# EAGLE design PCM2707C_HeadPhone_V2 (EAGLE 6.4)
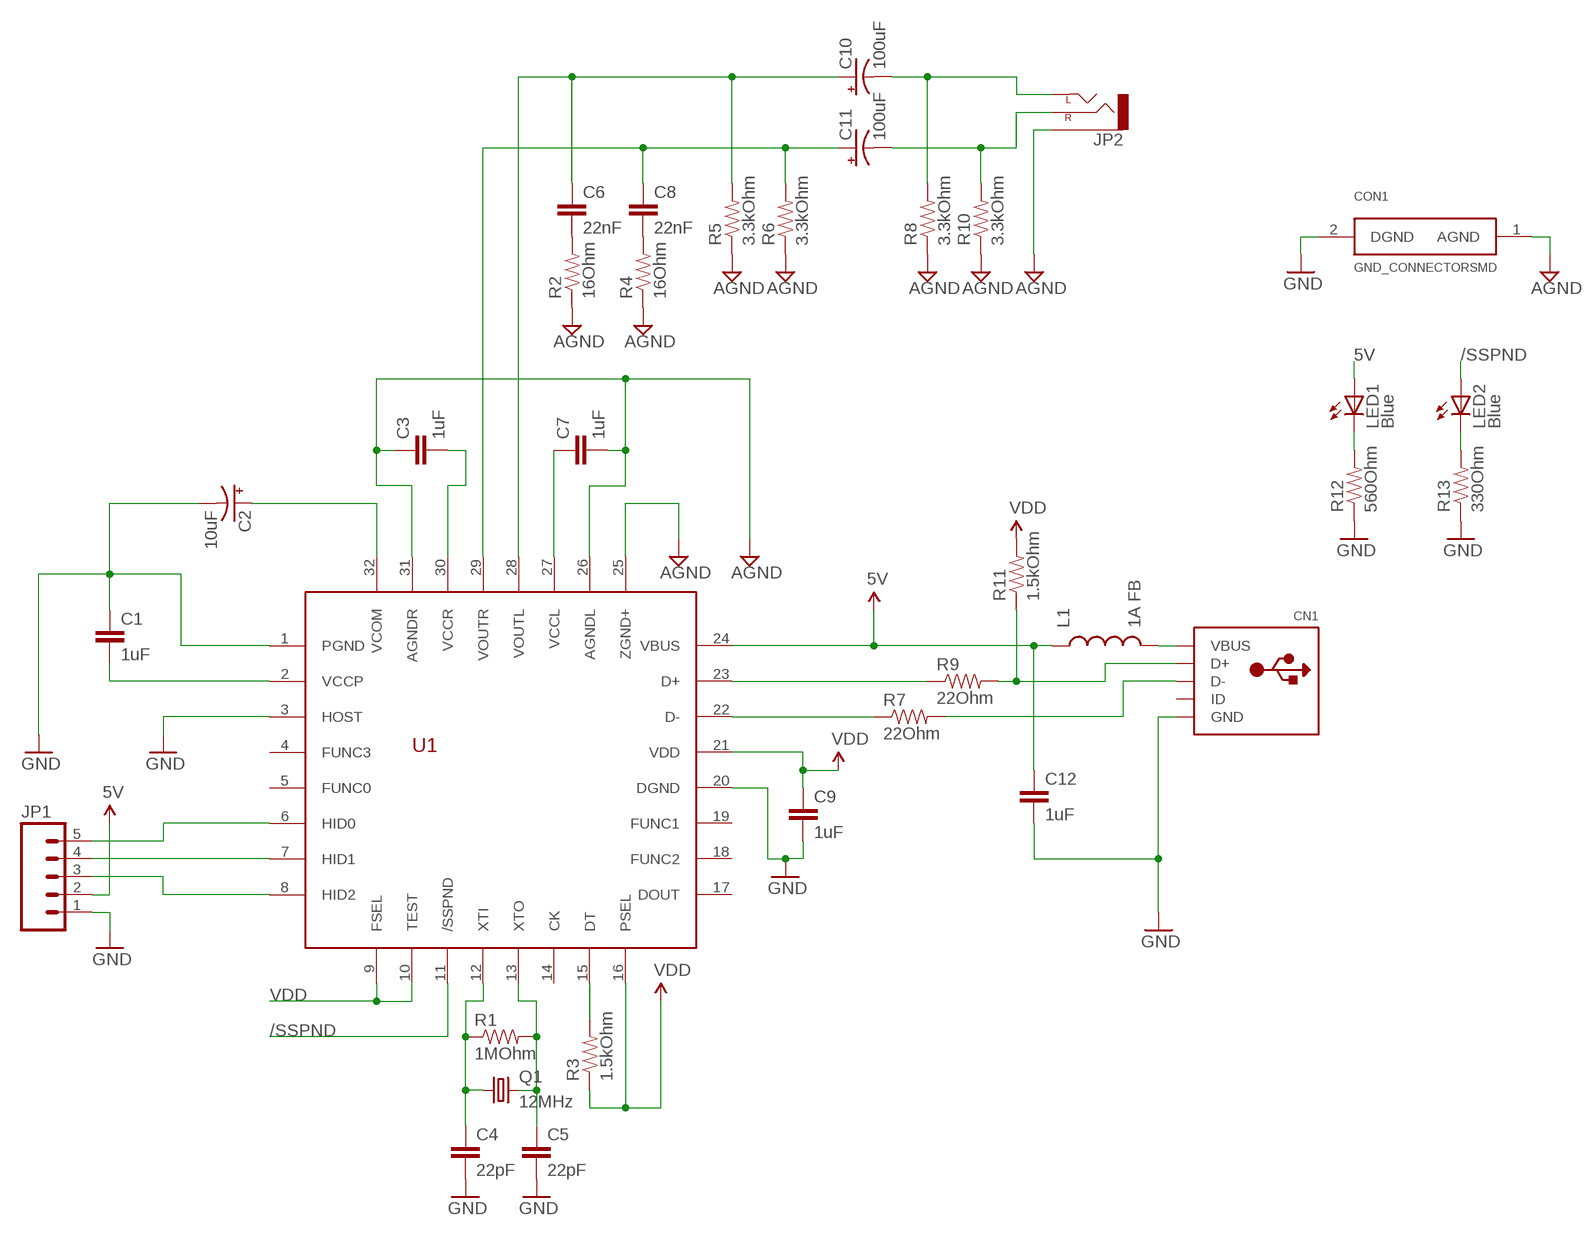
[diagram p0: schematic, sheet 1]

## Parts
C1  1uF  CAP0805  [0805]
C2  10uF  CAP_POLC  [PANASONIC_C]
C3  1uF  CAP0805  [0805]
C4  22pF  CAP0805  [0805]
C5  22pF  CAP0805  [0805]
C6  22nF  CAP1210  [1210]
C7  1uF  CAP0805  [0805]
C8  22nF  CAP1210  [1210]
C9  1uF  CAP0805  [0805]
C10  100uF  CAP_POLD  [PANASONIC_D]
C11  100uF  CAP_POLD  [PANASONIC_D]
C12  1uF  CAP0805  [0805]
CN1  USBMINIB  [USB-MINIB]
CON1  GND_CONNECTORSMD  [GND_CONNECTOR]
JP1  M05LOCK  [1X05_LOCK]
JP2  AUDIO-JACKPTH  [AUDIO-JACK]
L1  1A FB  INDUCTOR0805  [0805]
LED1  Blue  LED0603  [LED-0603]
LED2  Blue  LED0603  [LED-0603]
Q1  12MHz  CRYSTALHC49U-V  [HC49U-V]
R1  1MOhm  RESISTOR0805-RES  [0805]
R2  16Ohm  RESISTOR0805-RES  [0805]
R3  1.5kOhm  RESISTOR0805-RES  [0805]
R4  16Ohm  RESISTOR0805-RES  [0805]
R5  3.3kOhm  RESISTOR0805-RES  [0805]
R6  3.3kOhm  RESISTOR0805-RES  [0805]
R7  22Ohm  RESISTOR0805-RES  [0805]
R8  3.3kOhm  RESISTOR0805-RES  [0805]
R9  22Ohm  RESISTOR0805-RES  [0805]
R10  3.3kOhm  RESISTOR0805-RES  [0805]
R11  1.5kOhm  RESISTOR0805-RES  [0805]
R12  560Ohm  RESISTOR0805-RES  [0805]
R13  330Ohm  RESISTOR0805-RES  [0805]
U1  PCM2707C_TQFP32"  [32TQFP_PCM2707C]

## Nets
5V: C12.1 JP1.2 L1.1 LED1.A U1.24(VBUS)
/SSPND: LED2.A U1.11(/SSPND)
AGND: C3.1 C7.2 CON1.1(AGND) JP2.SLEEVE R2.1 R4.1 R5.1 R6.1 R8.1 R10.1 U1.25(ZGND+) U1.26(AGNDL) U1.31(AGNDR)
GND: C1.1 C2.- C4.2 C5.2 C9.2 C12.2 CN1.GND CON1.2(DGND) JP1.1 R12.1 R13.1 U1.1(PGND) U1.3(HOST) U1.20(DGND)
N$1: JP1.5 U1.6(HID0)
N$2: C1.2 U1.2(VCCP)
N$3: JP1.4 U1.7(HID1)
N$4: C2.+ U1.32(VCOM)
N$5: JP1.3 U1.8(HID2)
N$6: CN1.VBUS L1.2
N$7: C4.1 Q1.1 R1.1 U1.12(XTI)
N$8: C5.1 Q1.2 R1.2 U1.13(XTO)
N$9: R9.1 U1.23(D+)
N$10: R7.1 U1.22(D-)
N$11: CN1.D+ R9.2 R11.1
N$12: CN1.D- R7.2
N$13: C3.2 U1.30(VCCR)
N$14: LED1.C R12.2
N$15: R3.2 U1.15(DT)
N$16: C7.1 U1.27(VCCL)
N$17: C8.2 R4.2
N$18: C6.2 R2.2
N$19: C11.- JP2.RING(RIGHT) R10.2
N$20: C10.- JP2.TIP(LEFT) R8.2
N$21: C8.1 C11.+ R6.2 U1.29(VOUTR)
N$22: LED2.C R13.2
N$23: C6.1 C10.+ R5.2 U1.28(VOUTL)
VDD: C9.1 R3.1 R11.2 U1.9(FSEL) U1.10(TEST) U1.16(PSEL) U1.21(VDD)
Unconnected: CN1.ID U1.4(FUNC3) U1.5(FUNC0) U1.14(CK) U1.17(DOUT) U1.18(FUNC2) U1.19(FUNC1)

## Library data of the parts
C1 C3-C9 C12 = SparkFun-Passives:CAP: Capacitor Standard 0603 ceramic capacitor, and 0.1" leaded capacitor.
C2 C10 C11 = SparkFun-Passives:CAP_POL: Capacitor Polarized These are standard SMD and PTH capacitors. Normally 10uF, 47uF, and 100uF in electrolytic and tantalum varieties. Always verify the external diameter of the through hole cap, it varies with capacity, voltage, and manufacturer. The EIA devices should be standard.
CN1 = adafruit:USB: USB Connectors USBMINIB - Surface Mount Female Mini-B USB Connector 4UConnector: 06564 By microbuilder.eu Thru-hole RA Female Mini-B USB Connector 4UConnector: 18732 By ladyada.net
CON1 = lowderlib:GND_CONNECTOR
JP1 = SparkFun-Connectors:M05: Header 5 Standard 5-pin 0.1" header. Use with straight break away headers (SKU : PRT-00116), right angle break away headers (PRT-00553), swiss pins (PRT-00743), machine pins (PRT-00117), and female headers (PRT-00115). Molex polarized connector foot print use with SKU : PRT-08230 with associated crimp pins and housings.
JP2 = SparkFun-Connectors:AUDIO-JACK: 3.5mm Audio Jack Simple 3.5mm common PCB mount audio jack. SKU: PRT-08032
L1 = SparkFun-Passives:INDUCTOR: Inductors Basic Inductor/Choke - 0603 and 1206. Footprints are not proven and vary greatly between part numbers. SRN6045- 33uH, 20% 1.4A SDR0403-560KL - 56uH, 10%, 500mA RMS/740mA peak
LED1 LED2 = SparkFun-LED:LED: LEDs Standard schematic elements and footprints for 5mm, 3mm, 1206, and 0603 sized LEDs. 5mm - Spark Fun Electronics SKU : COM-00529 (and others)
Q1 = crystal:CRYSTAL: CRYSTAL; OC_FARNELL: 1666969; OC_NEWARK: unknown
R1-R13 = SparkFun-Passives:RESISTOR: Resistor Basic schematic elements and footprints for 0603, 1206, and PTH resistors.
U1 = lowderlib:PCM2707C_TQFP32: Stereo Audio DAC with USB Interface, Single-Ended Headphone Output, and S/PDIF Output

## Board
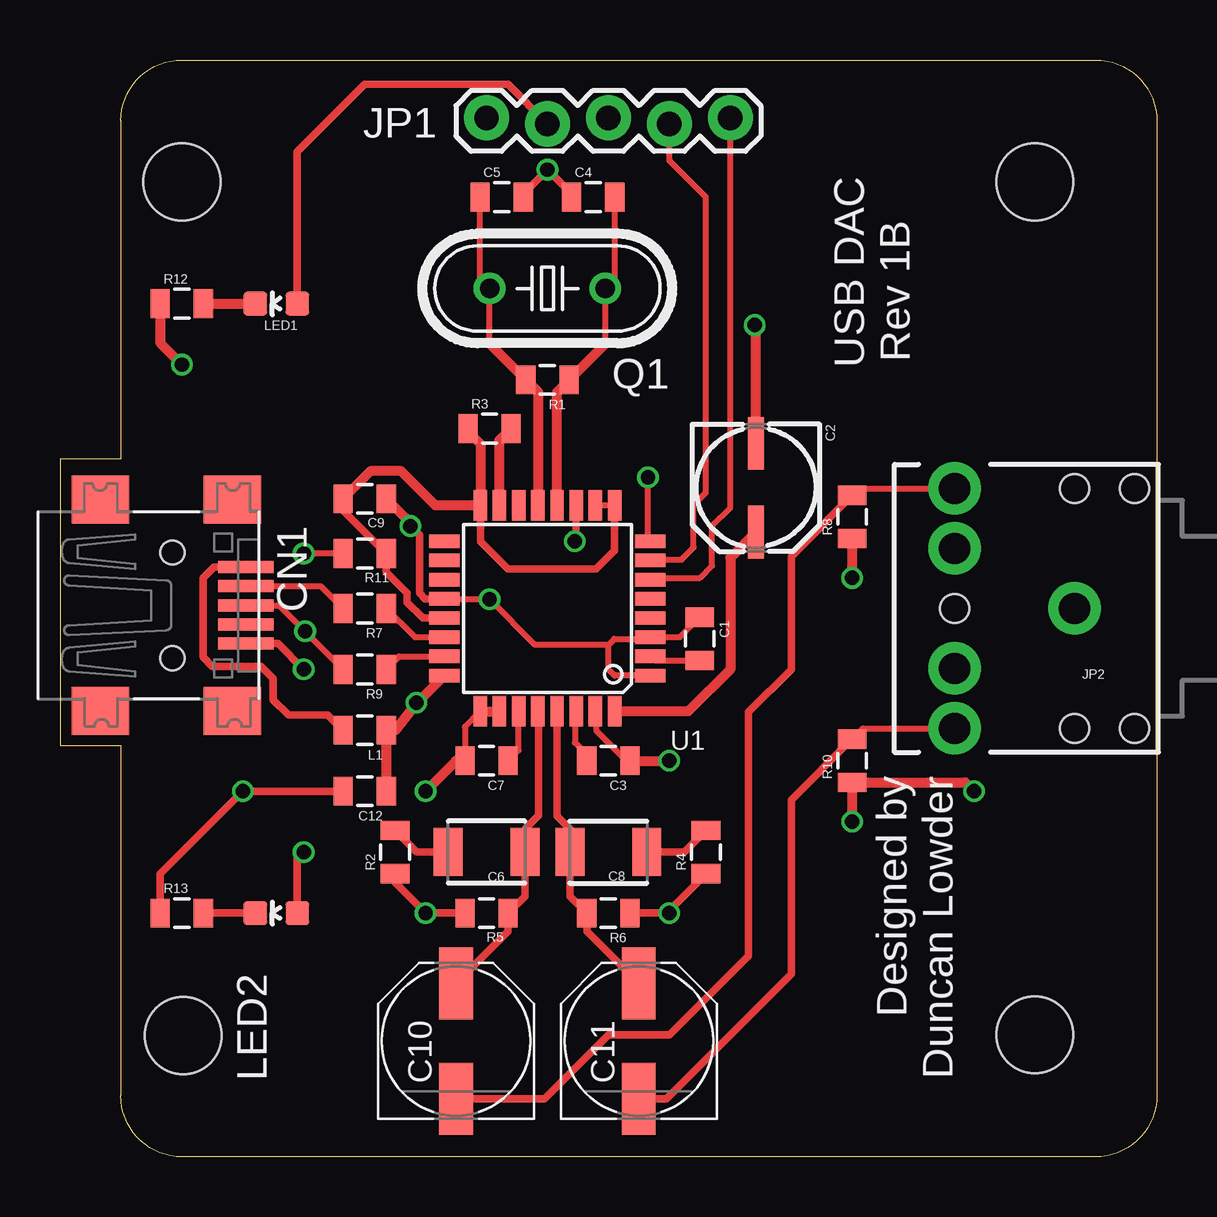
[diagram p1: board, top side]
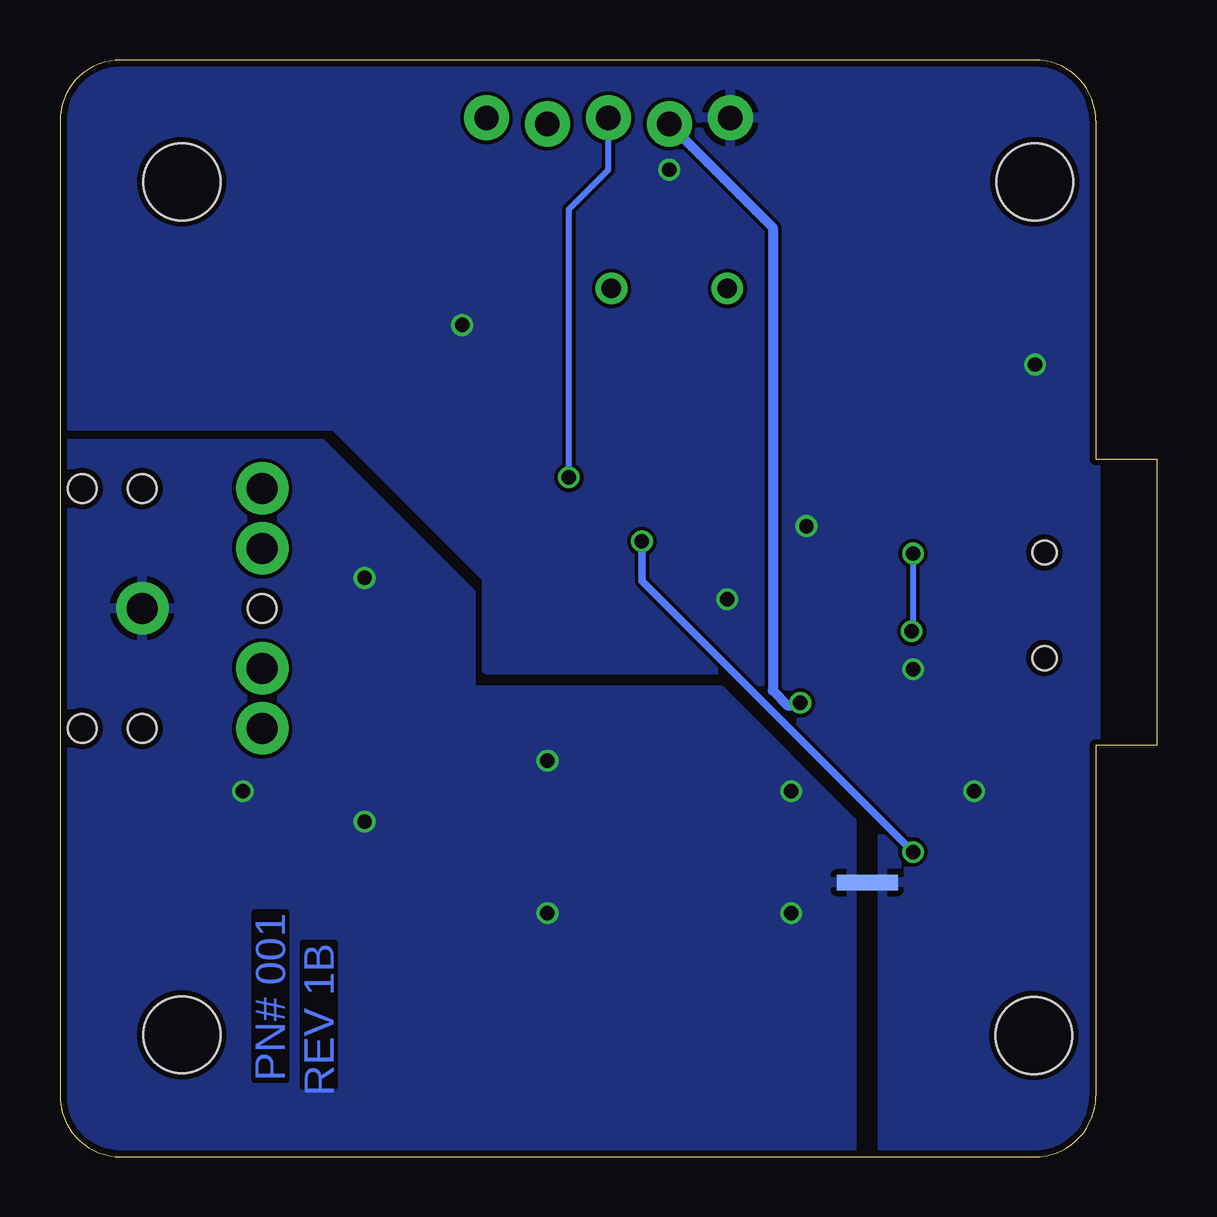
[diagram p2: board, bottom side, seen from below]

Size 45.72 x 45.72 mm. Coordinates in mm from the lower left corner, seen from the top.
Outline: 2.54,43.18 arc-90 5.08,45.72 43.18,45.72 arc-90 45.72,43.18 45.72,2.54 arc-90 43.18,0 5.08,0 arc-90 2.54,2.54 2.54,17.14 0,17.14 0,29.08 2.54,29.08 2.54,43.18
Copper layers (1*16): Top 0.035mm / dielectric 1.5mm / Bottom 0.035mm
Design rules "SeeedStudio_2layer_DRU_no_angle_20140221": minimum track width 6mil, minimum drill 12mil, track to track 6mil, track to pad 6mil, pad to pad 6mil, via to via 6mil, smd to smd 0mil, copper to edge 10mil, drill to drill 10mil, minimum pad ring 10mil, minimum via ring 6mil, stop-mask expansion 2mil, vias tented up to drill 100mil, thermal gap 10mil
Holes 3.2 mm at 5.08,40.64 40.64,40.64 40.64,5.08 5.13,5.05

### Footprints (pad centres in the part's own frame; a part is rotated, then mirrored left to right if it is on the bottom)
0805 = smd 0.8 x 1.2: 1 -0.9,0; 2 0.9,0
PANASONIC_C = smd 2.2 x 0.65: + 1.9,-0.2; - -1.8,-0.2
1210 = smd 1.2 x 2: 1 -1.6,0; 2 1.6,0
PANASONIC_D = smd 3 x 1.4: + 2.4,0; - -2.4,0
USB-MINIB = smd 0.5 x 2.308: D+ 0,4.064; D- -0.8,4.064; GND 1.6,4.064; ID 0.8,4.064; VBUS -1.6,4.064 | smd 2 x 2.4: GND1 -4.4,-2; GND2 -4.4,3.5; GND3 4.4,3.5; GND4 4.4,-2 | hole 1: -2.2,1; 2.2,1
GND_CONNECTOR = smd 1.27 x 0.635: 1 -1.27,0; 2 0,0
1X05_LOCK = drill 1.016 pad 1.88: 1 0,0.127; 2 2.54,-0.127; 3 5.08,0.127; 4 7.62,-0.127; 5 10.16,0.127
AUDIO-JACK = drill 1.3 pad 2.184: RING 5,5; RSH 5,2.5; SLEEVE 0,0; TIP 5,-5; TSH 5,-2.5 | hole 1.2: 0,5; -2.5,5; -2.5,-5; 0,-5; 5,0
LED-0603 = smd 1 x 1: A 0,-0.877; C 0,0.877
HC49U-V = drill 0.813: 1 -2.413,0; 2 2.413,0
32TQFP_PCM2707C = smd 1.27 x 0.559: 1 -4.293,2.8; 2 -4.293,2; 3 -4.293,1.2; 4 -4.293,0.4; 5 -4.293,-0.4; 6 -4.293,-1.2; 7 -4.293,-2; 8 -4.293,-2.8; 17 4.293,-2.8; 18 4.293,-2; 19 4.293,-1.2; 20 4.293,-0.4; 21 4.293,0.4; 22 4.293,1.2; 23 4.293,2; 24 4.293,2.8 | smd 0.559 x 1.27: 9 -2.8,-4.293; 10 -2,-4.293; 11 -1.2,-4.293; 12 -0.4,-4.293; 13 0.4,-4.293; 14 1.2,-4.293; 15 2,-4.293; 16 2.8,-4.293; 25 2.8,4.293; 26 2,4.293; 27 1.2,4.293; 28 0.4,4.293; 29 -0.4,4.293; 30 -1.2,4.293; 31 -2,4.293; 32 -2.8,4.293

### Placement (x,y rotation side)
C1  26.67,21.59 270 top
C2  29.21,27.94 270 top
C3  22.86,16.51 180 top
C4  22.23,40.01 180 top
C5  18.41,40.01 0 top
C6  17.78,12.7 180 top
C7  17.78,16.51 180 top
C8  22.86,12.7 0 top
C9  12.7,27.43 0 top
C10  16.51,4.83 90 top
C11  24.13,4.83 90 top
C12  12.7,15.24 180 top
CN1  3.68,22.99 270 top
CON1  11.43,11.43 0 bottom
JP1  17.78,43.18 0 top
JP2  42.29,22.86 180 top
L1  12.7,17.78 180 top
LED1  9.02,35.56 90 top
LED2  9.02,10.16 90 top
Q1  20.32,36.2 180 top
R1  20.32,32.38 180 top
R2  13.97,12.7 90 top
R3  17.91,30.35 0 top
R4  26.92,12.7 90 top
R5  17.78,10.16 0 top
R6  22.86,10.16 180 top
R7  12.7,22.86 180 top
R8  33.02,26.67 90 top
R9  12.7,20.32 180 top
R10  33.02,16.51 90 top
R11  12.7,25.15 0 top
R12  5.08,35.56 0 top
R13  5.08,10.16 0 top
U1  20.32,22.86 180 top

### Tracks (layer width: path | path; a pad name or v marks a point on that pad's centre or on a via)
5V  (via drill 0.6)
  Top 0.305: LED1.A 9.89,41.9 12.7,44.7 18.67,44.7 JP1.2
  Top 0.406: C12.1 L1.1 13.97,17.78 v14.86,18.92 14.99,19.02 U1.24
  Bottom 0.406: JP1.2 16,38.73 16,19.43 15.37,18.8 v14.86,18.92
/SSPND  (via drill 0.6)
  Top 0.305: U1.11 21.52,25.71 v21.46,25.65 | LED2.A 9.89,12.43 v10.16,12.7
  Bottom 0.305: v21.46,25.65 21.46,24 v10.16,12.7
AGND  (via drill 0.6)
  Top 0.254: U1.25 16.88,17.93 C7.2 | U1.31 22.35,18.54 22.35,17.78 23.62,16.51 C3.1
  Top 0.305: R2.1 13.97,11.43 v15.24,10.16 R5.1 | R6.1 v25.4,10.16 25.4,10.28 R4.1
  Top 0.406: R8.1 v33.02,24.13 | v33.02,13.97 R10.1 37.73,15.61 v38.1,15.24 | C7.2 16.51,16.51 v15.24,15.24 | C3.1 v25.4,16.51 | U1.25 U1.26
  Bottom 0.406: JP2.SLEEVE 41.91,22.86
  pour Bottom: 12.7,0 12.7,13.97 18.16,19.43 28.57,19.43 28.57,23.5 34.8,29.72 45.72,29.72 45.72,0
GND  (via drill 0.6)
  Top 0.254: U1.1 23.12,20.06 22.86,20.32 22.86,21.34 | 22.86,21.34 23.11,21.59 24.54,21.59 U1.3 25.84,21.66 C1.1 | U1.20 17.89,23.26 v17.91,23.24 19.81,21.34 22.86,21.34
  Top 0.305: U1.20 15.22,23.26 14.99,23.5 14.99,25.91 v14.61,26.29 | C12.2 v7.62,15.24 4.18,11.8 R13.1 | CN1.GND 9.09,21.39 v10.16,20.32 | C4.2 21.32,40.14 v20.32,41.15 19.32,40.14 C5.2
  Top 0.406: C2.- 29.01,34.62 v28.96,34.67 | v14.61,26.29 14.61,26.43 C9.2 | R12.1 4.18,33.92 v5.08,33.02
  pour Bottom: 2.54,45.72 45.72,45.72 45.72,30.48 34.29,30.48 27.94,24.13 27.94,20.32 17.78,20.32 11.43,13.97 11.43,0 2.54,0
N$1
  Top 0.254: U1.6 24.68,24.13 26.67,24.13 27.18,24.64 27.18,26.29 27.94,27.05 JP1.5
N$2
  Top 0.254: U1.2 24.78,20.69 C1.2
N$3
  Top 0.254: U1.7 24.64,24.89 25.91,24.89 26.42,25.4 26.42,27.18 26.92,27.69 26.92,40.01 25.4,41.53 JP1.4
N$4
  Top 0.406: C2.+ 27.94,24.97 27.94,20.32 26.19,18.57 U1.32
N$5  (via drill 0.6)
  Top 0.254: U1.8 24.51,25.76 v24.51,28.32
  Bottom 0.254: v24.51,28.32 24.51,39.5 22.86,41.15 JP1.3
N$6
  Top 0.305: CN1.VBUS 6.43,24.59 5.97,24.13 5.97,20.83 6.35,20.45 8.38,20.45 8.89,19.94 8.89,19.05 9.53,18.41 11.16,18.41 L1.2
N$7
  Top 0.254: 22.73,33.9 Q1.1 23.12,36.59 C4.1
  Top 0.406: U1.12 20.72,31.89 R1.1 22.73,33.9
N$8
  Top 0.254: 17.91,33.9 Q1.2 17.52,36.59 C5.1
  Top 0.406: U1.13 19.94,27.15 19.94,31.87 R1.2 17.91,33.9
N$9
  Top 0.254: R9.1 14.14,20.86 U1.23
N$10
  Top 0.254: R7.1 14.8,21.66 U1.22
N$11  (via drill 0.6)
  Top 0.254: CN1.D+ 9.13,22.99 10.15,21.96 v10.22,21.9 R9.2 | R11.1 v10.16,25.15
  Bottom 0.254: v10.16,25.15 10.16,21.96 v10.22,21.9
N$12
  Top 0.254: CN1.D- 10.87,23.79 R7.2
N$13
  Top 0.254: U1.30 21.46,18.51 21.46,17.27 21.96,16.77 C3.2
N$14
  Top 0.406: R12.2 LED1.C
N$15
  Top 0.406: U1.15 18.32,29.87 R3.2
N$16
  Top 0.254: C7.1 19.12,16.95 U1.27
N$17
  Top 0.305: C8.2 26.02,12.7 R4.2
N$18
  Top 0.305: C6.2 14.87,12.7 R2.2
N$19
  Top 0.254: R10.2 33.47,17.86 JP2.RING
  Top 0.305: C11.- 25.29,2.43 30.48,7.62 30.48,14.87 R10.2
N$20
  Top 0.254: R8.2 33.31,27.86 JP2.TIP
  Top 0.305: C10.- 20.21,2.43 22.86,5.08 25.4,5.08 28.7,8.38 28.7,18.54 30.48,20.32 30.48,25.03 R8.2
N$21
  Top 0.305: U1.29 20.72,14.21 21.34,13.59 21.34,12.78 C8.1 21.26,10.86 R6.2 21.96,9.4 C11.+
N$22
  Top 0.305: LED2.C R13.2
N$23
  Top 0.305: U1.28 19.94,18.57 19.94,14.22 19.43,13.72 19.43,12.75 C6.1 19.38,10.86 R5.2 18.68,9.4 C10.+
VDD
  Top 0.254: U1.9 U1.10
  Top 0.305: U1.21 15.13,22.46 14.48,23.11 14.48,23.5 13.59,24.38 13.59,25.14 R11.2 11.8,26.95 C9.1 | U1.16 17.53,25.65 18.67,24.51 22.35,24.51 23.11,25.27 U1.9
  Top 0.406: R3.1 17.01,30.24 17.53,29.72 U1.16 15.65,27.15 14.22,28.57 12.94,28.57 C9.1

### Text on the board
Bottom: PN# 001 | REV 1B
tPlace: USB DAC | Rev 1B | Designed by / Duncan Lowder